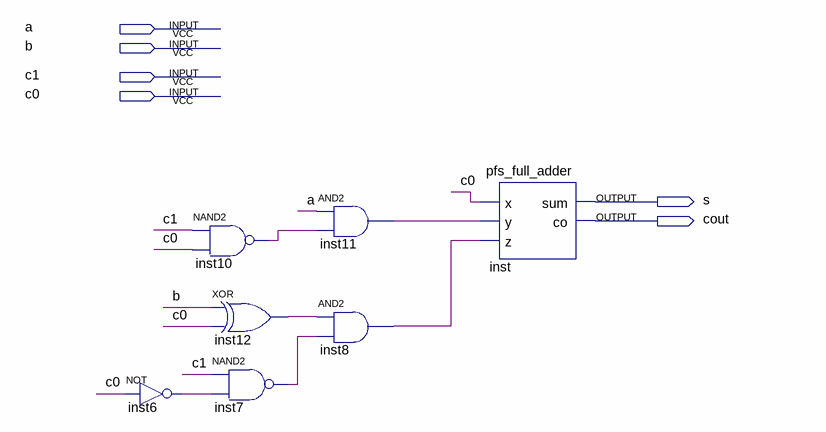
[diagram p0: schematic sheet]
// Quartus schematic pfs_add_select.bdf as structural Verilog: 7 symbols, 6 pins
module pfs_add_select (
  input  a,
  input  b,
  input  c1,
  input  c0,
  output s,
  output cout
);

  wire inst6_out, inst7_out, inst8_out, inst10_out, inst11_out, inst12_out;

  nand inst10 (inst10_out, c1, c0);
  not inst6 (inst6_out, c0);
  xor inst12 (inst12_out, b, c0);
  nand inst7 (inst7_out, c1, inst6_out);
  and inst11 (inst11_out, a, inst10_out);
  and inst8 (inst8_out, inst12_out, inst7_out);
  pfs_full_adder inst (.x(c0), .y(inst11_out), .z(inst8_out), .sum(s), .co(cout));
endmodule
